# Altium schematic sheet DisPlay.SchDoc
size A4
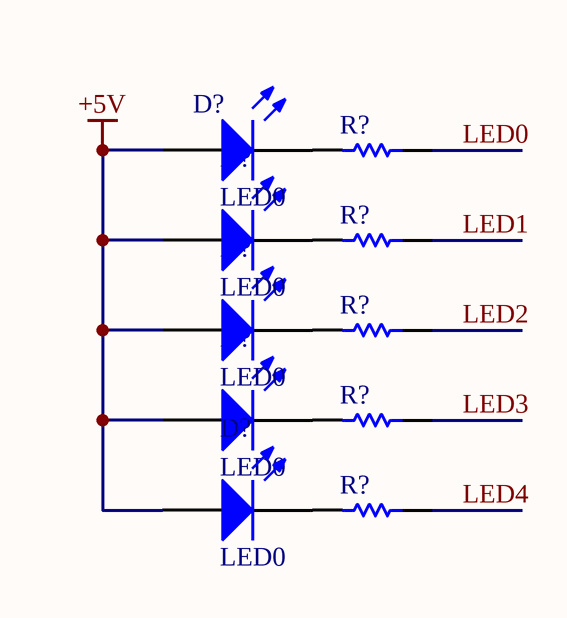
[diagram p0: DisPlay.SchDoc]

## Parts
(Parts that share a designator on the sheet are numbered #1, #2 ... from top to bottom, then left to right.)
D?#1  LED0  [LED-0]
D?#2  LED0  [LED-0]
D?#3  LED0  [LED-0]
D?#4  LED0  [LED-0]
D?#5  LED0  [LED-0]
R?#1  Res1  [RES(0805)]  (value not drawn)
R?#2  Res1  [RES(0805)]  (value not drawn)
R?#3  Res1  [RES(0805)]  (value not drawn)
R?#4  Res1  [RES(0805)]  (value not drawn)
R?#5  Res1  [RES(0805)]  (value not drawn)

## Nets
+5V: D?#1.1(A) D?#2.1(A) D?#3.1(A) D?#4.1(A) D?#5.1(A)
LED0: R?#1.1
LED1: R?#2.1
LED2: R?#3.1
LED3: R?#4.1
LED4: R?#5.1
NetD?#1_2: D?#1.2(K) R?#1.2
NetD?#2_2: D?#2.2(K) R?#2.2
NetD?#3_2: D?#3.2(K) R?#3.2
NetD?#4_2: D?#4.2(K) R?#4.2
NetD?#5_2: D?#5.2(K) R?#5.2

## Library data of the parts
D?#1-D?#5 = LED0: Typical INFRARED GaAs LED; Published: 8-Jun-2000; LatestRevisionDate: 08-Jul-2005; LatestRevisionNote: Mech Layer 1 removed.; PackageReference: LED-0; Publisher: Altium Limited
R?#1-R?#5 = Res1: Resistor; Value: 1K; Published: 8-Jun-2000; LatestRevisionDate: 17-Jul-2002; LatestRevisionNote: Re-released for DXP Platform.; PackageReference: AXIAL-0.3; Publisher: Altium Limited